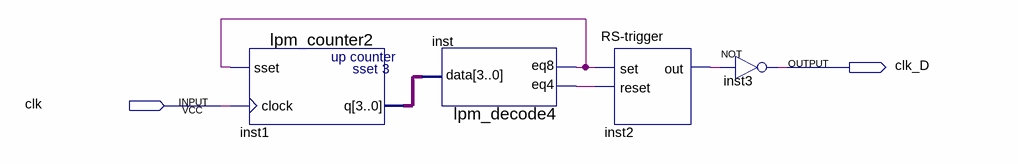
[diagram p0: schematic sheet]
// Quartus schematic Devider_REMOTE_1114.bdf as structural Verilog: 4 symbols, 2 pins
module Devider_REMOTE_1114 (
  input  clk,
  output clk_D
);

  wire inst2_out, inst_eq4, inst_eq8;
  wire [3:0] inst1_q;

  lpm_counter2 inst1 (.sset(inst_eq8), .clock(clk), .q(inst1_q));
  lpm_decode4 inst (.data(inst1_q), .eq4(inst_eq4), .eq8(inst_eq8));
  \RS-trigger  inst2 (.set(inst_eq8), .reset(inst_eq4), .out(inst2_out));
  not inst3 (clk_D, inst2_out);
endmodule
